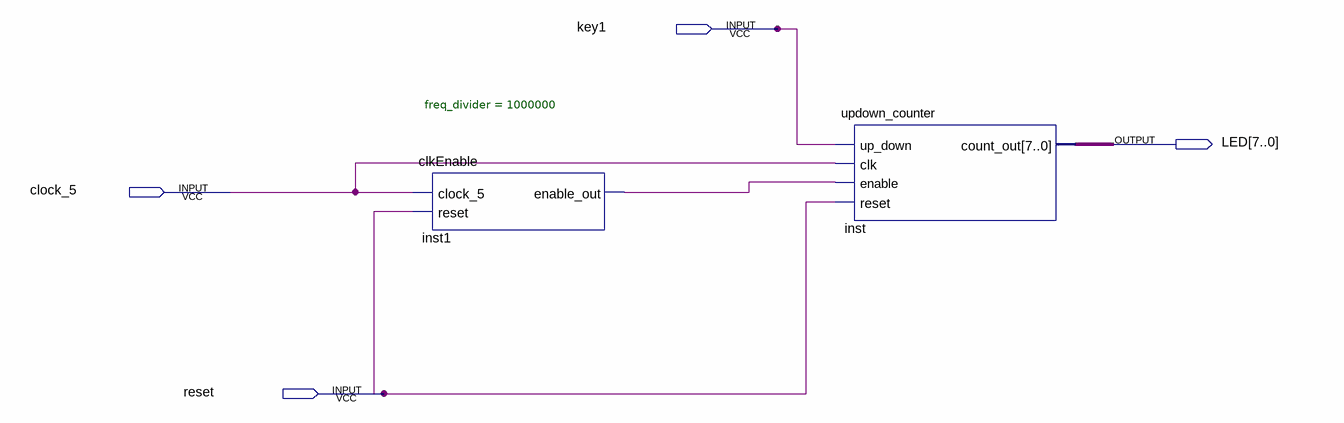
[diagram p0: schematic sheet]
// Quartus schematic 8_bit_updown_counter.bdf as structural Verilog: 2 symbols, 4 pins
module \8_bit_updown_counter  (
  input  key1,
  input  clock_5,
  input  reset,
  output [7:0] LED
);

  wire inst1_enable_out;

  clkEnable #(.freq_divider(1000000)) inst1 (.clock_5(clock_5), .reset(reset), .enable_out(inst1_enable_out));
  updown_counter inst (.up_down(key1), .clk(clock_5), .enable(inst1_enable_out), .reset(reset), .count_out(LED));
endmodule
